# EAGLE schematic heater (EAGLE 9.2.0)
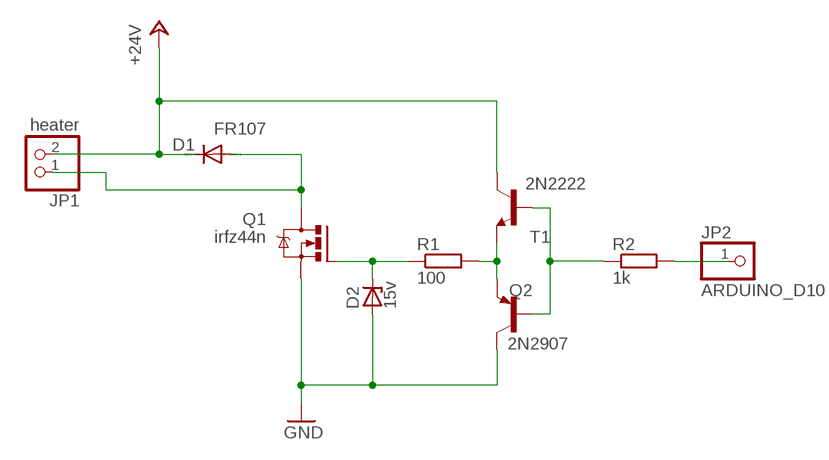
[diagram p0: schematic, sheet 1]

## Parts
D1  FR107  1N4004  [DO41-10]
D2  15v  ZENER-DIODEDO34-7  [DO34Z7]
JP1  heater  PINHD-1X2  [1X02]
JP2  ARDUINO_D10  PINHD-1X1  [1X01]
Q1  irfz44n  IRLZ44Z  [TO220BH]
Q2  2N2907  2N2905  [TO5]
R1  100  R-EU_0204/5  [0204/5]
R2  1k  R-EU_0204/5  [0204/5]
T1  2N2222  [TO18]

## Nets
+24V: D1.C JP1.2 T1.3(C)
GND: D2.A Q1.S Q2.3(C)
N$1: D1.A JP1.1 Q1.D
N$2: D2.C Q1.G R1.1
N$3: Q2.1(E) R1.2 T1.1(E)
N$5: Q2.2(B) R2.1 T1.2(B)
N$6: JP2.1 R2.2

## Library data of the parts
D1 = diode:1N4004: DIODE general purpose rectifier, 1 A
D2 = diode:ZENER-DIODE: Z-Diode
JP1 = pinhead:PINHD-1X2: PIN HEADER
JP2 = pinhead:PINHD-1X1: PIN HEADER
Q1 = transistor-power:IRLZ44Z: N-Channel HEXFET® Power MOSFET Logic Level AUTOMOTIVE MOSFET Source: http://www.irf.com/product-info/datasheets/data/irlz44zpbf.pdf
Q2 = transistor-pnp:2N2905: PNP Transistor
R1 R2 = rcl:R-EU_: RESISTOR, European symbol; SPICEPREFIX: R
T1 = transistor:2N2222: NPN TRANSISTOR